# Altium project LimeSDR-X3_1v2.PrjPcb (part 14 of 16)

## Sheet 29_Clocks2.SchDoc: Clocks 2
size A3; Organization: Lime Microsystems; Address1: Surrey Tech Centre; Address2: Guildford GU2 7YG; Address3: Surrey; Address4: United Kingdom; Revision: v1.1; SheetNumber: 29; SheetTotal: 31
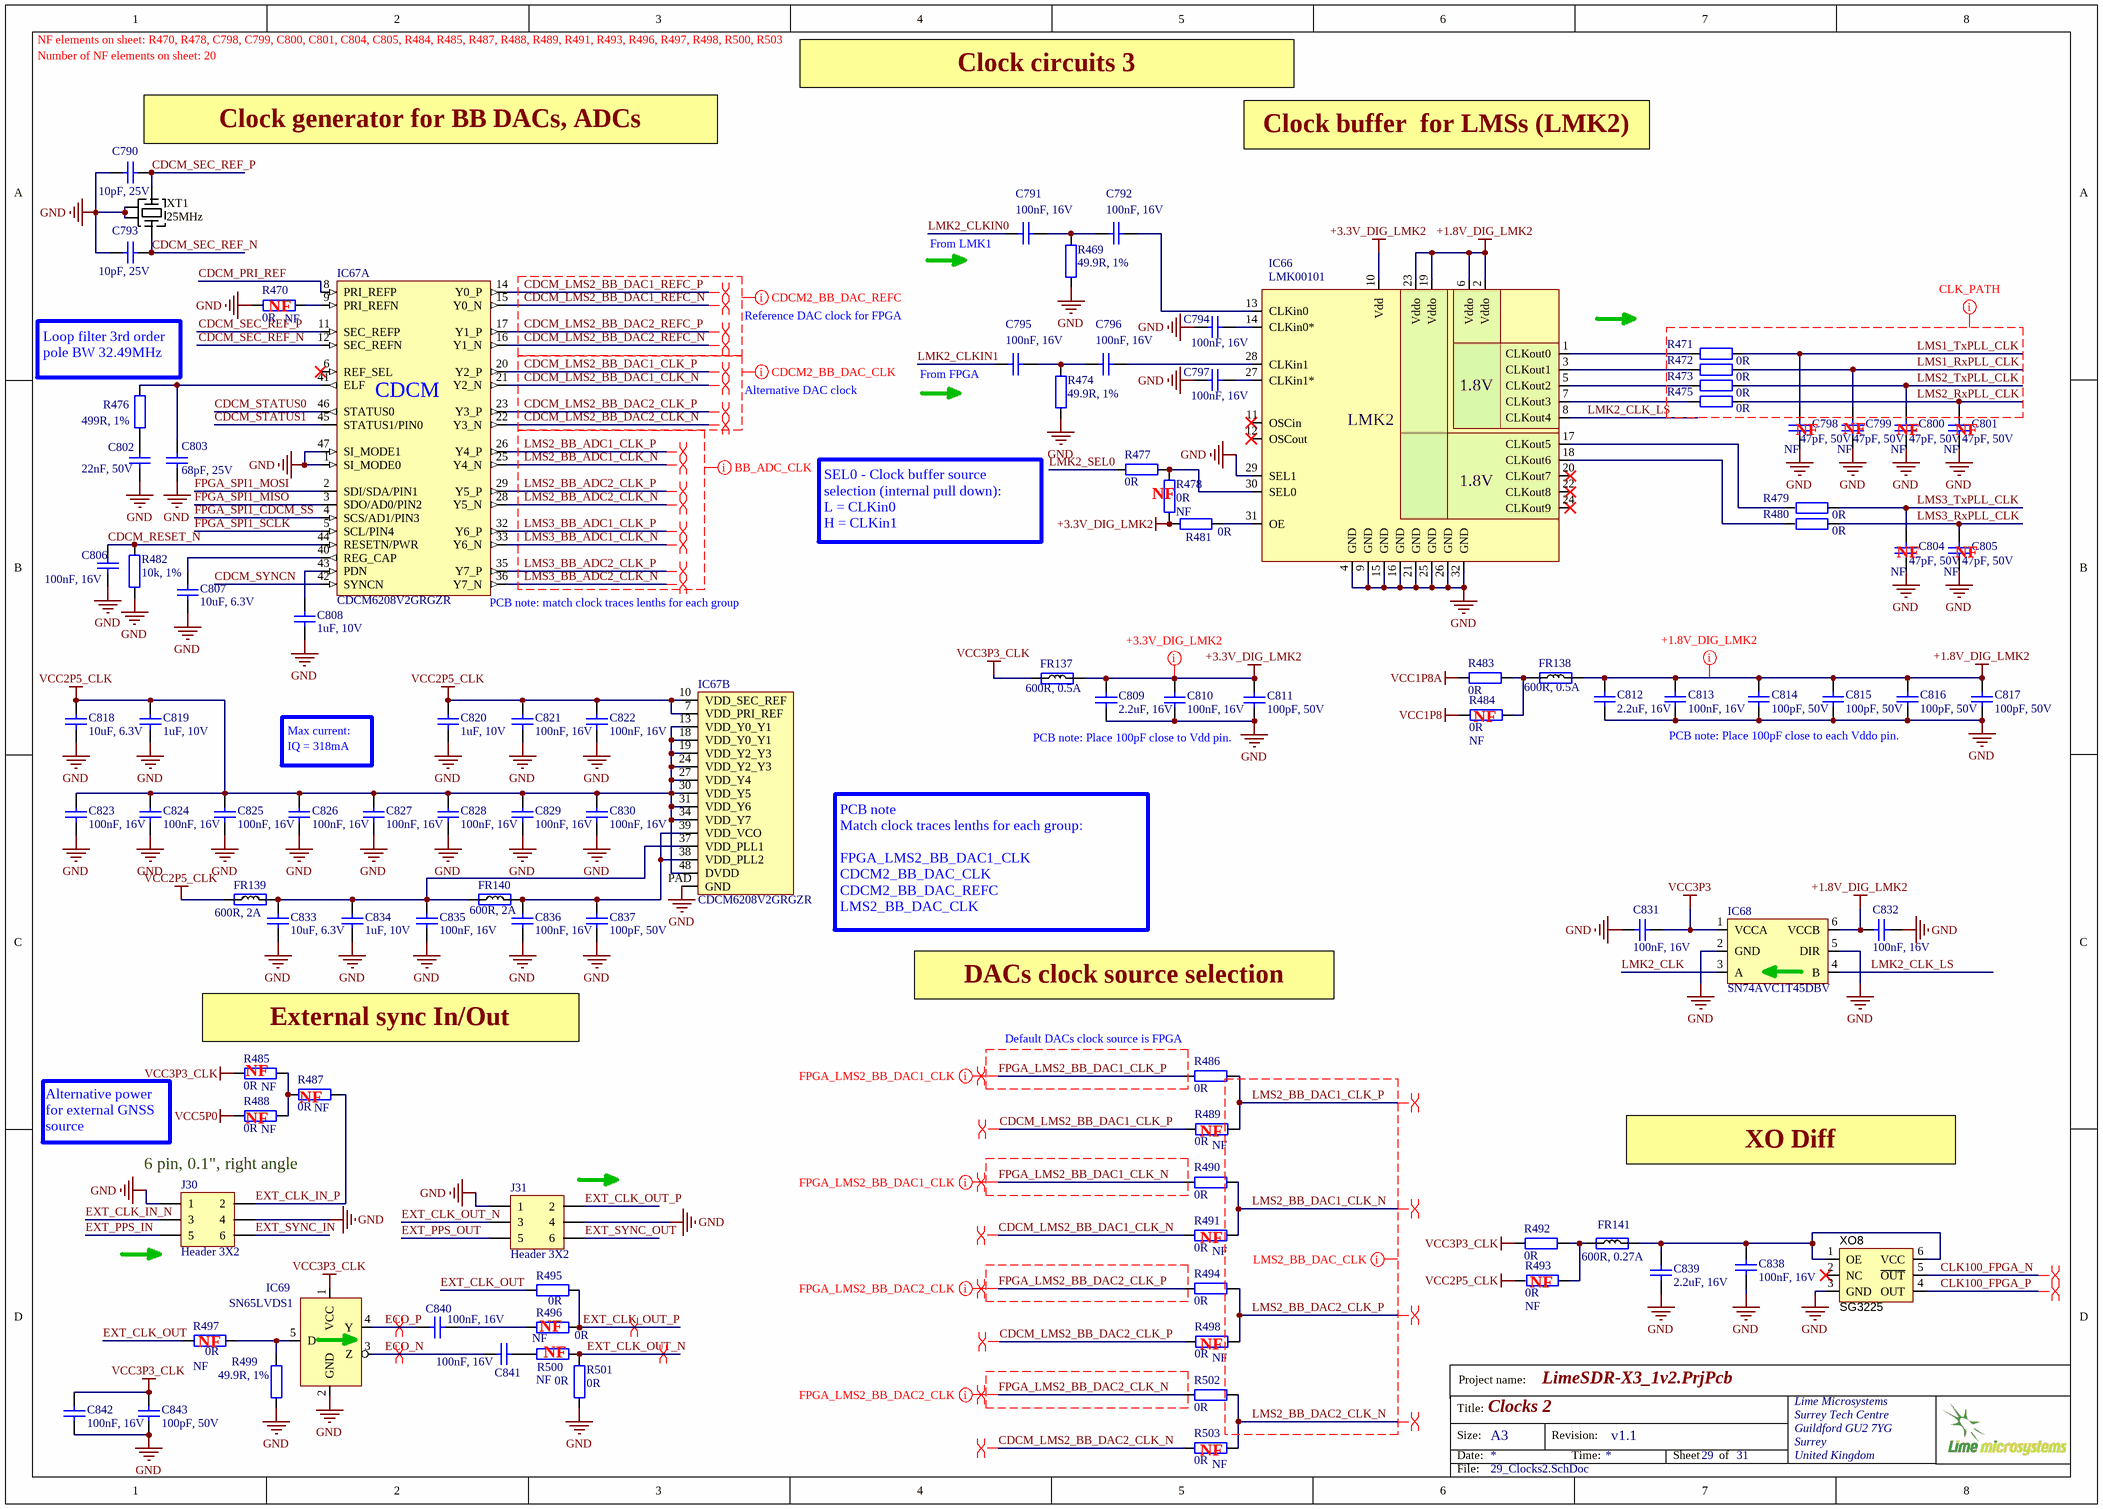
[diagram p17: 29_Clocks2.SchDoc]

### Parts
C790  10pF, 25V  [CAP0402]
C791  100nF, 16V  [CAP0402]
C792  100nF, 16V  [CAP0402]
C793  10pF, 25V  [CAP0402]
C794  100nF, 16V  [CAP0402]
C795  100nF, 16V  [CAP0402]
C796  100nF, 16V  [CAP0402]
C797  100nF, 16V  [CAP0402]
C798  47pF, 50V  Assembly Info: NF  [CAP0402]
C799  47pF, 50V  Assembly Info: NF  [CAP0402]
C800  47pF, 50V  Assembly Info: NF  [CAP0402]
C801  47pF, 50V  Assembly Info: NF  [CAP0402]
C802  22nF, 50V  [CAP0402]
C803  68pF, 25V  [CAP0402]
C804  47pF, 50V  Assembly Info: NF  [CAP0402]
C805  47pF, 50V  Assembly Info: NF  [CAP0402]
C806  100nF, 16V  [CAP0402]
C807  10uF, 6.3V  [CAP0603]
C808  1uF, 10V  [CAP0402]
C809  2.2uF, 16V  [CAP0402]
C810  100nF, 16V  [CAP0402]
C811  100pF, 50V  [CAP0402]
C812  2.2uF, 16V  [CAP0402]
C813  100nF, 16V  [CAP0402]
C814  100pF, 50V  [CAP0402]
C815  100pF, 50V  [CAP0402]
C816  100pF, 50V  [CAP0402]
C817  100pF, 50V  [CAP0402]
C818  10uF, 6.3V  [CAP0603]
C819  1uF, 10V  [CAP0402]
C820  1uF, 10V  [CAP0402]
C821  100nF, 16V  [CAP0402]
C822  100nF, 16V  [CAP0402]
C823  100nF, 16V  [CAP0402]
C824  100nF, 16V  [CAP0402]
C825  100nF, 16V  [CAP0402]
C826  100nF, 16V  [CAP0402]
C827  100nF, 16V  [CAP0402]
C828  100nF, 16V  [CAP0402]
C829  100nF, 16V  [CAP0402]
C830  100nF, 16V  [CAP0402]
C831  100nF, 16V  [CAP0402]
C832  100nF, 16V  [CAP0402]
C833  10uF, 6.3V  [CAP0603]
C834  1uF, 10V  [CAP0402]
C835  100nF, 16V  [CAP0402]
C836  100nF, 16V  [CAP0402]
C837  100pF, 50V  [CAP0402]
C838  100nF, 16V  [CAP0402]
C839  2.2uF, 16V  [CAP0402]
C840  100nF, 16V  [CAP0402]
C841  100nF, 16V  [CAP0402]
C842  100nF, 16V  [CAP0402]
C843  100pF, 50V  [CAP0402]
FR137  value 600R, 0.5A  [RES0402]  (hidden comment: Ferrite)
FR138  value 600R, 0.5A  [RES0402]  (hidden comment: Ferrite)
FR139  600R, 2A  [RES0805]
FR140  600R, 2A  [RES0805]
FR141  value 600R, 0.27A  [RES0201]  (hidden comment: Ferrite)
IC66  LMK00101  [LMK00101_WQFN32]
IC67  CDCM6208V2GRGZR  [CDCM6208V2G _VQFN48]  (parts A,B of 2)
IC68  SN74AVC1T45DBV  [SOT23-6]
IC69  SN65LVDS1  [SOT23-5]
J30  Header 3X2  [BHR-06-HUA_2x3_EDGE_HEADER]
J31  Header 3X2  [BHR-06-HUA_2x3_EDGE_HEADER]
R469  49.9R, 1%  [RES0402]
R470  0R  Assembly Info: NF  [RES0402]
R471  0R  [RES0402]
R472  0R  [RES0402]
R473  0R  [RES0402]
R474  49.9R, 1%  [RES0402]
R475  0R  [RES0402]
R476  499R, 1%  [RES0402]
R477  0R  [RES0402]
R478  0R  Assembly Info: NF  [RES0402]
R479  0R  [RES0402]
R480  0R  [RES0402]
R481  0R  [RES0402]
R482  10k, 1%  [RES0402]
R483  0R  [RES0402]
R484  0R  Assembly Info: NF  [RES0402]
R485  0R  Assembly Info: NF  [RES0402]
R486  0R  [RES0402]
R487  0R  Assembly Info: NF  [RES0402]
R488  0R  Assembly Info: NF  [RES0402]
R489  0R  Assembly Info: NF  [RES0402]
R490  0R  [RES0402]
R491  0R  Assembly Info: NF  [RES0402]
R492  0R  [RES0402]
R493  0R  Assembly Info: NF  [RES0402]
R494  0R  [RES0402]
R495  0R  [RES0402]
R496  0R  Assembly Info: NF  [RES0402]
R497  0R  Assembly Info: NF  [RES0402]
R498  0R  Assembly Info: NF  [RES0402]
R499  49.9R, 1%  [RES0402]
R500  0R  Assembly Info: NF  [RES0402]
R501  0R  [RES0402]
R502  0R  [RES0402]
R503  0R  Assembly Info: NF  [RES0402]
XO8  SG3225  [CRYSTAL_6-LCC]
XT1  25MHz  [CRYSTAL_4-LCC]

### Nets
+1.8V_DIG_LMK2: C812.2 C813.2 C814.2 C815.2 C816.2 C817.2 C832.1 FR138.2 IC66.2(Vddo) IC66.6(Vddo) IC66.19(Vddo) IC66.23(Vddo) IC68.6(VCCB)
+3.3V_DIG_LMK2: C809.2 C810.2 C811.2 FR137.2 IC66.10(Vdd) R478.2 R481.1
GND: C790.1 C793.1 C794.1 C797.1 C798.1 C799.1 C800.1 C801.1 C802.2 C803.2 C804.1 C805.1 C806.1 C807.2 C808.2 C809.1 C810.1 C811.1 C812.1 C813.1 C814.1 C815.1 C816.1 C817.1 C818.2 C819.2 C820.2 C821.1 C822.1 C823.1 C824.1 C825.1 C826.1 C827.1 C828.1 C829.1 C830.1 C831.1 C832.2 C833.2 C834.2 C835.1 C836.1 C837.1 C838.1 C839.1 C842.2 C843.1 IC66.4(GND) IC66.9(GND) IC66.15(GND) IC66.16(GND) IC66.21(GND) IC66.25(GND) IC66.26(GND) IC66.29(SEL1) IC66.32(GND) IC67.1(SI_MODE0) IC67.47(SI_MODE1) IC67.PAD(GND) IC68.2(GND) IC68.5(DIR) IC69.2(GND) J30.1 J30.4 J31.1 J31.4 R469.1 R470.2 R474.1 R482.2 R499.1 R501.1 XO8.3(GND) XT1.2(GND) XT1.4(GND)
VCC1P8: R484.2
VCC1P8A: R483.1
VCC2P5_CLK: C818.1 C819.1 C820.1 C821.2 C822.2 C823.2 C824.2 C825.2 C826.2 C827.2 C828.2 C829.2 C830.2 FR139.1 IC67.7(VDD_PRI_REF) IC67.10(VDD_SEC_REF) IC67.13(VDD_Y0_Y1) IC67.18(VDD_Y0_Y1) IC67.19(VDD_Y2_Y3) IC67.24(VDD_Y2_Y3) IC67.27(VDD_Y4) IC67.30(VDD_Y5) IC67.31(VDD_Y6) IC67.34(VDD_Y7) IC67.48(DVDD) R493.2
VCC3P3: C831.2 IC68.1(VCCA)
VCC3P3_CLK: C842.1 C843.2 FR137.1 IC69.1(VCC) R485.1 R492.1
VCC5P0: R488.1
CDCM_LMS2_BB_DAC1_CLK_N: IC67.21(Y2_N) R491.1
CDCM_LMS2_BB_DAC1_CLK_P: IC67.20(Y2_P) R489.1
CDCM_LMS2_BB_DAC1_REFC_N: IC67.15(Y0_N)
CDCM_LMS2_BB_DAC1_REFC_P: IC67.14(Y0_P)
CDCM_LMS2_BB_DAC2_CLK_N: IC67.22(Y3_N) R503.1
CDCM_LMS2_BB_DAC2_CLK_P: IC67.23(Y3_P) R498.1
CDCM_LMS2_BB_DAC2_REFC_N: IC67.16(Y1_N)
CDCM_LMS2_BB_DAC2_REFC_P: IC67.17(Y1_P)
CDCM_PRI_REF: IC67.8(PRI_REFP)
CDCM_RESET_N: C806.2 IC67.44(RESETN/PWR) R482.1
CDCM_SEC_REF_N: C793.2 IC67.12(SEC_REFN) XT1.3(X)
CDCM_SEC_REF_P: C790.2 IC67.11(SEC_REFP) XT1.1(X)
CDCM_STATUS0: IC67.46(STATUS0)
CDCM_STATUS1: IC67.45(STATUS1/PIN0)
CDCM_SYNCN: IC67.42(SYNCN)
CLK100_FPGA_N: XO8.5(~{OUT})
CLK100_FPGA_P: XO8.4(OUT)
ECO_N: C841.1 IC69.3(Z)
ECO_P: C840.1 IC69.4(Y)
EXT_CLK_IN_N: J30.3
EXT_CLK_IN_P: J30.2 R487.2
EXT_CLK_OUT: R495.2 R497.2
EXT_CLK_OUT_N: J31.3 R500.1 R501.2
EXT_CLK_OUT_P: J31.2 R495.1 R496.1
EXT_PPS_IN: J30.5
EXT_PPS_OUT: J31.5
EXT_SYNC_IN: J30.6
EXT_SYNC_OUT: J31.6
FPGA_LMS2_BB_DAC1_CLK_N: R490.1
FPGA_LMS2_BB_DAC1_CLK_P: R486.1
FPGA_LMS2_BB_DAC2_CLK_N: R502.1
FPGA_LMS2_BB_DAC2_CLK_P: R494.1
FPGA_SPI1_CDCM_SS: IC67.4(SCS/AD1/PIN3)
FPGA_SPI1_MISO: IC67.3(SDO/AD0/PIN2)
FPGA_SPI1_MOSI: IC67.2(SDI/SDA/PIN1)
FPGA_SPI1_SCLK: IC67.5(SCL/PIN4)
LMK2_CLK: IC68.3(A)
LMK2_CLK_LS: IC66.8(CLKout4) IC68.4(B)
LMK2_CLKIN0: C791.2
LMK2_CLKIN1: C795.2
LMK2_SEL0: R477.1
LMS1_RxPLL_CLK: C799.2 R472.1
LMS1_TxPLL_CLK: C798.2 R471.1
LMS2_BB_ADC1_CLK_N: IC67.25(Y4_N)
LMS2_BB_ADC1_CLK_P: IC67.26(Y4_P)
LMS2_BB_ADC2_CLK_N: IC67.28(Y5_N)
LMS2_BB_ADC2_CLK_P: IC67.29(Y5_P)
LMS2_BB_DAC1_CLK_N: R490.2 R491.2
LMS2_BB_DAC1_CLK_P: R486.2 R489.2
LMS2_BB_DAC2_CLK_N: R502.2 R503.2
LMS2_BB_DAC2_CLK_P: R494.2 R498.2
LMS2_RxPLL_CLK: C801.2 R475.1
LMS2_TxPLL_CLK: C800.2 R473.1
LMS3_BB_ADC1_CLK_N: IC67.33(Y6_N)
LMS3_BB_ADC1_CLK_P: IC67.32(Y6_P)
LMS3_BB_ADC2_CLK_N: IC67.36(Y7_N)
LMS3_BB_ADC2_CLK_P: IC67.35(Y7_P)
LMS3_RxPLL_CLK: C805.2 R480.1
LMS3_TxPLL_CLK: C804.2 R479.1
NetC791_1: C791.1 C792.2 R469.2
NetC792_1: C792.1 IC66.13(CLKin0)
NetC794_2: C794.2 IC66.14(CLKin0*)
NetC795_1: C795.1 C796.2 R474.2
NetC796_1: C796.1 IC66.28(CLKin1)
NetC797_2: C797.2 IC66.27(CLKin1*)
NetC802_1: C802.1 R476.2
NetC803_1: C803.1 IC67.41(ELF) R476.1
NetC807_1: C807.1 IC67.40(REG_CAP)
NetC808_1: C808.1 IC67.43(PDN)
NetC833_1: C833.1 C834.1 C835.2 FR139.2 FR140.1 IC67.37(VDD_PLL1)
NetC836_2: C836.2 C837.2 FR140.2 IC67.38(VDD_PLL2) IC67.39(VDD_VCO)
NetC838_2: C838.2 C839.2 FR141.2 XO8.1(OE) XO8.6(VCC)
NetC840_2: C840.2 R496.2
NetC841_2: C841.2 R500.2
NetFR138_1: FR138.1 R483.2 R484.1
NetFR141_1: FR141.1 R492.2 R493.1
NetIC66_1: IC66.1(CLKout0) R471.2
NetIC66_3: IC66.3(CLKout1) R472.2
NetIC66_5: IC66.5(CLKout2) R473.2
NetIC66_7: IC66.7(CLKout3) R475.2
NetIC66_17: IC66.17(CLKout5) R479.2
NetIC66_18: IC66.18(CLKout6) R480.2
NetIC66_30: IC66.30(SEL0) R477.2 R478.1
NetIC66_31: IC66.31(OE) R481.2
NetIC67_9: IC67.9(PRI_REFN) R470.1
NetIC69_5: IC69.5(D) R497.1 R499.2
NetR485_2: R485.2 R487.1 R488.2

Not connected (* = marked no-connect by the designer): IC66 11(OSCin)* 12(OSCout)* 20(CLKout7)* 22(CLKout8)* 24(CLKout9)*; IC67 6(REF_SEL)*; XO8 2(NC)*

### Layout directives
net class CLK_PATH: CDCM_LMS2_BB_DAC1_CLK_N, CDCM_LMS2_BB_DAC1_CLK_P, CDCM_LMS2_BB_DAC1_REFC_N, CDCM_LMS2_BB_DAC1_REFC_P, CDCM_LMS2_BB_DAC2_CLK_N, CDCM_LMS2_BB_DAC2_CLK_P, CDCM_LMS2_BB_DAC2_REFC_N, CDCM_LMS2_BB_DAC2_REFC_P, FPGA_LMS2_BB_DAC1_CLK_N, FPGA_LMS2_BB_DAC1_CLK_P, FPGA_LMS2_BB_DAC2_CLK_N, FPGA_LMS2_BB_DAC2_CLK_P, LMS1_RxPLL_CLK, LMS1_TxPLL_CLK, LMS2_BB_ADC1_CLK_N, LMS2_BB_ADC1_CLK_P, LMS2_BB_ADC2_CLK_N, LMS2_BB_ADC2_CLK_P, LMS2_BB_DAC1_CLK_N, LMS2_BB_DAC1_CLK_P, LMS2_BB_DAC2_CLK_N, LMS2_BB_DAC2_CLK_P, LMS2_RxPLL_CLK, LMS2_TxPLL_CLK, LMS3_BB_ADC1_CLK_N, LMS3_BB_ADC1_CLK_P, LMS3_BB_ADC2_CLK_N, LMS3_BB_ADC2_CLK_P
net class +1.8V_DIG_LMK: +1.8V_DIG_LMK2
net class +3.3V_DIG_LMK: +3.3V_DIG_LMK2
differential pair: CDCM_LMS2_BB_DAC1_CLK_N, CDCM_LMS2_BB_DAC1_CLK_P, CDCM_LMS2_BB_DAC1_REFC_N, CDCM_LMS2_BB_DAC1_REFC_P, CDCM_LMS2_BB_DAC2_CLK_N, CDCM_LMS2_BB_DAC2_CLK_P, CDCM_LMS2_BB_DAC2_REFC_N, CDCM_LMS2_BB_DAC2_REFC_P, CLK100_FPGA_N, CLK100_FPGA_P, ECO_N, ECO_P, EXT_CLK_OUT_N, EXT_CLK_OUT_P, FPGA_LMS2_BB_DAC1_CLK_N, FPGA_LMS2_BB_DAC1_CLK_P, FPGA_LMS2_BB_DAC2_CLK_N, FPGA_LMS2_BB_DAC2_CLK_P, LMS2_BB_ADC1_CLK_N, LMS2_BB_ADC1_CLK_P, LMS2_BB_ADC2_CLK_N, LMS2_BB_ADC2_CLK_P, LMS2_BB_DAC1_CLK_N, LMS2_BB_DAC1_CLK_P, LMS2_BB_DAC2_CLK_N, LMS2_BB_DAC2_CLK_P, LMS3_BB_ADC1_CLK_N, LMS3_BB_ADC1_CLK_P, LMS3_BB_ADC2_CLK_N, LMS3_BB_ADC2_CLK_P

### Notes on the sheet
- NF elements on sheet: R470, R478, C798, C799, C800, C801, C804, C805, R484, R485, R487, R488, R489, R491, R493, R496, R497, R498, R500, R503
- Number of NF elements on sheet: 20
- Clock circuits 3
- (near C790) Clock generator for BB DACs, ADCs
- Clock buffer  for LMSs (LMK2)
- (near C791) From LMK1
- (near R470) NF
- (near R476) Loop filter 3rd order pole BW 32.49MHz
- Reference DAC clock for FPGA
- (near C795) From FPGA
- (near IC67) CDCM
- Alternative DAC clock
- (near IC66) LMK2
- (near IC66) 1.8V
- (near C798) NF
- (near C799) NF
- (near C800) NF
- (near C801) NF
- (near R478) NF
- SEL0 - Clock buffer source selection (internal pull down):
  L = CLKin0
  H = CLKin1
- (near C804) NF
- (near C805) NF
- (near IC67) PCB note: match clock traces lenths for each group
- (near R484) NF
- IQ = 318mA
- Max current:
- PCB note: Place 100pF close to Vdd pin.
- PCB note: Place 100pF close to each Vddo pin.
- PCB note
  Match clock traces lenths for each group:
  FPGA_LMS2_BB_DAC1_CLK
  CDCM2_BB_DAC_CLK
  CDCM2_BB_DAC_REFC
  LMS2_BB_DAC_CLK
- (near R485) External sync In/Out
- DACs clock source selection
- (near R486) Default DACs clock source is FPGA
- (near R488) NF
- (near R485) NF
- (near R487) NF
- Alternative power for external GNSS source
- 6 pin, 0.1", right angle
- (near R489) NF
- XO Diff
- (near R491) NF
- (near R493) NF
- (near R497) NF
- (near R496) NF
- NF
- (near R498) NF
- (near R503) NF
- Project name:
- Title:
- Size:
- Date:
- A3
- Revision:
- Time:
- Sheet
- of
- File:

### Library data of the parts
C790 C793 = Cap_0402: Manufacturer: AVX; Part Description: 10pF ±5% 25V C0G, NP0 Ceramic Capacitor -55°C ~ 125°C Surface Mount, MLCC 0402 (1005 Metric) 0.039" L x 0.020" W (1.00mm x 0.50mm); Manufacturer Part Number 1: 04023A100JAT2A; Capacitance: 10; Ceramic Capacitor Case: 0402 [1005 Metric]; Capacitance Tolerance: ± 5%; Capacitor Case Style: 0402 [1005 Metric]<!--FANDB--><div class="features-and-benefits-container"></div>; Dielectric Characteristic: C0G / NP0; SVHC: No SVHC (16-Jun-2014); Voltage Rating: 25; Supplier 1: Farnell; Supplier Part Number 1: 2332478RL; value: 10pF, 25V; Capacitance Tolerance ±: ± 5%; MSL: MSL 1 - Unlimited; Operating Temperature Max: 125; Operating Temperature Min: -55; Packaging: Cut Tape; Product Range: -; RoHS: YES
C791 C792 C794-C797 C810 C813 = Cap_0402: as C737-C739 on sheet 28_Clocks1; Value: 100nF, 16V; Supplier 1: Mouser; Supplier Part Number 1: 81-GRM155R71C104KA88; Case Code - in: 0402; RoHS: RoHS Compliant; Operating Temperature Range: - 55 C to + 125 C; Series: GRM; Termination Style: SMD/SMT; Package / Case: 0402 (1005 metric); Voltage Rating DC: 16 V; Maximum Operating Temperature: + 125 C; Case Code - mm: 1005; Minimum Operating Temperature: - 55 C; Product Category: Low & Medium Capacitance SMD Ceramic Chip Capacitors; Packaging: Reel; Product: General Type MLCCs; Category: Multilayer Ceramic Capacitors MLCC - SMD/SMT; Brand: Murata Electronics; Case Width: 0.5 mm; RoHS - Mouser: Y; Standard Pack Qty: 10000; Minimum Order Quantity: 1; Reeling: True; Manufacturer Part Number 1: GRM155R71C104KA88D
C798-C801 C804 C805 = Cap_0402: Manufacturer Part Number 1: C1005C0G1H470F050BA; Manufacturer: TDK Corporation; Part Description: 47pF ±1% 50V Ceramic Capacitor C0G, NP0 0402 (1005 Metric); Temperature Coefficient: C0G, NP0; Tolerance: ±1%; Value: 47pF, 50V; Supplier 1: Digi-Key; Supplier Part Number 1: 445-5361-1-ND; Package / Case: 0402 (1005 Metric); Voltage - Rated: 50V; Lead Spacing: -; Ratings: -; Mounting Type: Surface Mount, MLCC; Operating Temperature: -55°C ~ 125°C; Thickness (Max): 0.022" (0.55mm); Capacitance: 47pF; Packaging: Cut Tape (CT); Features: -; Applications: General Purpose; Lead Style: -; Size / Dimension: 0.039" L x 0.020" W (1.00mm x 0.50mm); Height - Seated (Max): -; RoHS: RoHS Compliant; Category: Capacitors
C802 = Cap_0402: Manufacturer: Kemet; Manufacturer Part Number 1: C0402C223K5RACTU; Part Description: 0.022µF ±10% 50V Ceramic Capacitor X7R 0402 (1005 Metric); Temperature Coefficient: X7R; Tolerance: ±10%; Capacitance: 0.022µF; Value: 22nF, 50V; Supplier 1: Digi-Key; Supplier Part Number 1: 399-7780-1-ND; Ratings: -; Packaging: Cut Tape (CT); Category: Capacitors; Size / Dimension: 0.039" L x 0.020" W (1.00mm x 0.50mm); RoHS: RoHS Compliant; Operating Temperature: -55°C ~ 125°C; Mounting Type: Surface Mount, MLCC; Applications: General Purpose; Voltage - Rated: 50V; Thickness (Max): 0.022" (0.55mm); Features: -; Height - Seated (Max): -; Lead Style: -; Package / Case: 0402 (1005 Metric); Lead Spacing: -
C803 = Cap_0402: Manufacturer Part Number 1: CBR04C680F3GAC; Manufacturer: Kemet; Part Description: 68pF ±1% 25V Ceramic Capacitor C0G, NP0 0402 (1005 Metric); Temperature Coefficient: C0G, NP0; Tolerance: ±1%; Value: 68pF, 25V; Supplier 1: Digi-Key; Supplier Part Number 1: 399-11255-1-ND; Applications: RF, Microwave, High Frequency; Voltage - Rated: 25V; Capacitance: 68pF; Mounting Type: Surface Mount, MLCC; Package / Case: 0402 (1005 Metric); Features: High Q, Low Loss; Lead Spacing: -; Size / Dimension: 0.039" L x 0.020" W (1.00mm x 0.50mm); Operating Temperature: -55°C ~ 125°C; Packaging: Cut Tape (CT); Thickness (Max): 0.022" (0.55mm); Category: Capacitors; Lead Style: -; Ratings: -; Height - Seated (Max): -; RoHS: RoHS Compliant
C806 C821-C830 C835 C836 = Cap_0402: as C744 on sheet 28_Clocks1; Value: 100nF, 16V; Supplier 1: Mouser; Supplier Part Number 1: 81-GRM155R71C104KA88; Case Code - in: 0402; RoHS: RoHS Compliant; Operating Temperature Range: - 55 C to + 125 C; Series: GRM; Termination Style: SMD/SMT; Package / Case: 0402 (1005 metric); Voltage Rating DC: 16 V; Maximum Operating Temperature: + 125 C; Case Code - mm: 1005; Minimum Operating Temperature: - 55 C; Product Category: Low & Medium Capacitance SMD Ceramic Chip Capacitors; Packaging: Reel; Product: General Type MLCCs; Category: Multilayer Ceramic Capacitors MLCC - SMD/SMT; Brand: Murata Electronics; Case Width: 0.5 mm; RoHS - Mouser: Y; Standard Pack Qty: 10000; Minimum Order Quantity: 1; Reeling: True
C807 C818 C833 = Cap_0603: as C761 on sheet 28_Clocks1; Supplier 1: Digi-Key; Supplier Part Number 1: 311-1448-2-ND; Package / Case: 0603 (1608 Metric); Category: Capacitors; Voltage - Rated: 6.3V; Value: 10uF, 6.3V
C808 C819 C820 C834 = Cap_0402: as C771 on sheet 28_Clocks1; Value: 1uF, 10V; Supplier 1: Digi-Key; Supplier Part Number 1: 445-9066-1-ND; MSL: -; RoHS: YES
C809 C812 C839 = Cap_0402: as C749 on sheet 28_Clocks1; Value: 2.2uF, 16V; Supplier 1: Digi-Key; Supplier Part Number 1: 445-9085-6-ND; Category: Capacitors; Voltage - Rated: 16V; Thickness (Max): 0.022" (0.55mm); Applications: General Purpose; Package / Case: 0402 (1005 Metric); Size / Dimension: 0.039" L x 0.020" W (1.00mm x 0.50mm); Features: -; Temperature Coefficient: X5R; Mounting Type: Surface Mount, MLCC; Ratings: -; Lead Style: -; Operating Temperature: -55°C ~ 85°C; Lead Spacing: -; RoHS: RoHS Compliant; Height - Seated (Max): -; Packaging: Tape & Reel (TR); Operating Temperature Range: -55°C to +85
C811 C814-C817 C837 C843 = Cap_0402: as C751-C753 on sheet 28_Clocks1; Value: 100pF, 50V; Supplier 1: Digi-Key; Supplier Part Number 1: 311-1024-1-ND; RoHS: RoHS Compliant; Category: Capacitors; Applications: General Purpose; Mounting Type: Surface Mount, MLCC; Capacitance: 100pF; Ratings: -; Packaging: Cut Tape (CT); Voltage - Rated: 50V; Size / Dimension: 0.039" L x 0.020" W (1.00mm x 0.50mm); Height - Seated (Max): -; Package / Case: 0402 (1005 Metric); Operating Temperature: -55°C ~ 125°C; Features: -; Lead Spacing: -; Lead Style: -; Thickness (Max): 0.022" (0.55mm)
C831 C832 = Cap_0603: Part Description: 0.10µF ±10% 16V X7R Ceramic Capacitor -55°C ~ 125°C Surface Mount, MLCC 0402 (1005 Metric) 0.039" L x 0.020" W (1.00mm x 0.50mm); Manufacturer Part Number 1: GRM155R71C104KA88D; Brand: Murata Electronics; Tolerance: 10 %; Type: General Purpose MLCC; Capacitance: 0.1 uF; Temperature Coefficient / Code: +/- 15 %; Case Height: 0.5 mm; Case Length: 1 mm; Dielectric: X7R; Supplier 1: Mouser; Supplier Part Number 1: 81-GRM155R71C104KA88; Case Code - in: 0402; Manufacturer: Murata Electronics; Category: Multilayer Ceramic Capacitors MLCC - SMD/SMT; Voltage Rating DC: 16 V; Value: 100nF, 16V; Case Code - mm: 1005; Case Width: 0.5 mm; Maximum Operating Temperature: + 125 C; Minimum Operating Temperature: - 55 C; Minimum Order Quantity: 1; Operating Temperature Range: - 55 C to + 125 C; Package / Case: 0402 (1005 metric); Packaging: Reel; Product: General Type MLCCs; Product Category: Low & Medium Capacitance SMD Ceramic Chip Capacitors; Reeling: True; RoHS - Mouser: Y; RoHS: RoHS Compliant; Series: GRM; Standard Pack Qty: 10000; Termination Style: SMD/SMT
C838 C840-C842 = Cap_0603: as C785 on sheet 28_Clocks1; Supplier 1: Mouser; Supplier Part Number 1: 81-GRM155R71C104KA88; Case Code - in: 0402; Manufacturer: Murata Electronics; Category: Multilayer Ceramic Capacitors MLCC - SMD/SMT; Voltage Rating DC: 16 V; Value: 100nF, 16V; Case Code - mm: 1005; Case Width: 0.5 mm; Maximum Operating Temperature: + 125 C; Minimum Operating Temperature: - 55 C; Minimum Order Quantity: 1; Operating Temperature Range: - 55 C to + 125 C; Package / Case: 0402 (1005 metric); Packaging: Reel; Product: General Type MLCCs; Product Category: Low & Medium Capacitance SMD Ceramic Chip Capacitors; Reeling: True; RoHS - Mouser: Y; RoHS: RoHS Compliant; Series: GRM; Standard Pack Qty: 10000; Termination Style: SMD/SMT
  C840-C842: Manufacturer Part Number: GRM155R71C104KA88D
FR137 FR138 = Ferrite: as FR133-FR135 on sheet 28_Clocks1; Supplier 1: Digi-Key; Supplier Part Number 1: 490-5441-1-ND; Stock 1: 416370; Pricing 1: 1=0.1, 10=0.06, 25=0.0552, 50=0.0496, 100=0.0363, 250=0.0264, 500=0.0242, 1000=0.0209, 5000=0.0165 (USD); Case/Package: 0402; Number of Pins: 2; Case Code (Metric): 1005; Case Code (Imperial): 0402; Core Material: Ferrite; Material: Steel,Ferrite; Min Operating Temperature: -55°C; Max Operating Temperature: 125°C; Package Quantity: 1; Packaging: Tape and Reel; Series: BLM15AX_SN; Max Current Rating: 500mA; Termination: SMD/SMT; Max DC Current: 500mA; Number of Circuits: 1; DC Resistance-Max: 340mR; Length: 1mm; Width: 0.5mm; Height: 0.5mm; Depth: 0.5mm; REACH SVHC: No SVHC; Lead Free: Lead Free; RoHS Compliant: Yes; ComponentLink1URL: https://www.murata.com/en-us/products/productdata/8796740059166/ENFA0018.pdf?src-supplier=Digi-Key; ComponentLink1Description: https://www.murata.com/en-us/products/productdata/8796740059166/ENFA0018.pdf?src-supplier=Digi-Key; ComponentLink2URL: http://search.murata.co.jp/Ceramy/image/img/PDF/ENG/L0110S0100BLM15AX_SN.pdf?src-supplier=Future+Electronics; ComponentLink2Description: http://search.murata.co.jp/Ceramy/image/img/PDF/ENG/L0110S0100BLM15AX_SN.pdf?src-supplier=Future+Electronics; ComponentLink3URL: http://www.produktinfo.conrad.com/datenblaetter/1100000-1199999/001171675-da-01-en-CHIP_DROSSEL0402_600R_420MA_1_0X0_5MM.pdf?src-supplier=Conrad; ComponentLink3Description: http://www.produktinfo.conrad.com/datenblaetter/1100000-1199999/001171675-da-01-en-CHIP_DROSSEL0402_600R_420MA_1_0X0_5MM.pdf?src-supplier=Conrad; ComponentLink4URL: http://www.produktinfo.conrad.com/datenblaetter/1100000-1199999/001172169-da-01-en-DROSSEL_0402_600R_1_0X0_5MM_10000ST.pdf?src-supplier=Conrad; ComponentLink4Description: http://www.produktinfo.conrad.com/datenblaetter/1100000-1199999/001172169-da-01-en-DROSSEL_0402_600R_1_0X0_5MM_10000ST.pdf?src-supplier=Conrad
FR139 FR140 = Ferrite: Manufacturer Part Number 1: MPZ2012S601AT000; Manufacturer: TDK Corporation; Part Description: FERRITE BEAD 600 OHM 0805 1LN; Filter Type: Differential Mode - Single; Impedance @ Frequency: 600 Ohm @ 100MHz; DC Resistance (DCR): 100 mOhm Max; Supplier 1: Digi-Key; Supplier Part Number 1: 445-2206-2-ND; Mounting Type: Surface Mount; RoHS: RoHS Compliant; Height (Max): 0.041" (1.05mm); Packaging: Tape & Reel (TR); Category: Filters; Current Rating: 2A; Package / Case: 0805 (2012 Metric); Size / Dimension: 0.079" L x 0.049" W (2.00mm x 1.25mm); Value: 600R, 2A
FR141 = Ferrite: as FR136 on sheet 28_Clocks1; Supplier 1: Digi-Key; Supplier Part Number 1: 587-3277-1-ND; Size / Dimension: 0.024" L x 0.012" W (0.60mm x 0.30mm); Package / Case: 0201 (0603 Metric); Height (Max): 0.013" (0.33mm); Mounting Type: Surface Mount; Packaging: Cut Tape (CT); RoHS: RoHS Compliant; Category: Filters
IC66 = LMK00101: as IC62 on sheet 28_Clocks1; Supplier 1: Digi-Key; Mounting Type: Surface Mount; Package / Case: 32-WFQFN Exposed Pad; RoHS: RoHS Compliant; Operating Temperature: -40°C ~ 85°C; Type: Fanout Buffer (Distribution), Multiplexer, Translator; Category: Integrated Circuits (ICs); Packaging: Cut Tape (CT); Supplier Device Package: 32-WQFN (5x5); Supplier Part Number 1: 296-39036-1-ND
IC67 = CDCM6208V2GRGZR: Manufacturer: Texas Instruments; Part Description: IC CLK GEN 2:8 LOW JITTER 48VQFN; Number of Circuits: 1; Max Frequency: 800MHz; Input: Crystal; Number of Outputs: 8; Supplier 1: Digi-Key; Manufacturer Part Number 1: CDCM6208V2GRGZR; Stock 1: 1501; Pricing 1: 1 = 11,22000, 10 = 10,13400, 100 = 8,38960, 500 = 7,30558, 1000 = 6,36293 (USD); RoHS: Yes; Mount: Surface Mount; Case/Package: VQFN; Min Operating Temperature: -40°C; Max Operating Temperature: 85°C; Packaging: Tape and Reel; Lead Free: Lead Free; ComponentLink1URL: http://www.ti.com/lit/ds/symlink/cdcm6208v2g.pdf?src-supplier=Digi-Key; ComponentLink1Description: http://www.ti.com/lit/ds/symlink/cdcm6208v2g.pdf?src-supplier=Digi-Key; ComponentLink2URL: http://www.ti.com/lit/gpn/cdcm6208v2g?src-supplier=Mouser; ComponentLink2Description: http://www.ti.com/lit/gpn/cdcm6208v2g?src-supplier=Mouser; Supplier Part Number 1: 296-51011-1-ND
IC68 = SN74AVC1T45DBV: Manufacturer: Texas Instruments; Part Description: Voltage Level Translator Bidirectional 1 Circuit 1 Channel 500Mbps SOT-23-6; Manufacturer Part Number 1: SN74AVC1T45DBVR; Data Rate: 500Mbps; Voltage - Supply: 1.2 V ~ 3.6 V; Supplier 1: Digi-Key; Category: Integrated Circuits (ICs); Package / Case: SOT-23-6; Supplier Part Number 1: 296-19094-1-ND
IC69 = SN65LVDS1: Manufacturer: TEXAS INSTRUMENTS; Manufacturer Part Number 1: SN65LVDS1DBVR; Part Description: DIFFERENTIAL LINE DRIVER/RECEIVER SIGNAL SOT23-5; Supply Voltage Min: 2.4; Supply Voltage Max: 3.6; No. of Pins: 5; Driver Case Style: SOT-23; Supplier 1: Newark; Supplier Part Number 1: 76C0715
J30 J31 = Header 3X2: Header, 2-Pin, Dual row; Manufacturer: Adam Equipment; Manufacturer Part Number 1: BHR-06-HUA; Part Description: Connector Header Through Hole, Right Angle 6 position 0.100" (2.54mm); Supplier 1: Digi-Key; Supplier Part Number 1: 2057-BHR-06-HUA-ND; Stock 1: 1572; Pricing 1: 1=0.3, 10=0.283, 100=0.198, 500=0.16968, 1000=0.1414, 5000=0.1212, 10000=0.11312 (USD)
R469 R474 R499 = Res_0402: as R418 on sheet 28_Clocks1; Number of Terminations: 2; Size / Dimension: 0.039" L x 0.020" W (1.00mm x 0.50mm); Supplier Device Package: 0402 (1005 Metric); RoHS: RoHS Compliant; Supplier Part Number 1: 1276-3469-6-ND; Features: -; Packaging: Digi-Reel®; Tolerance: ±1%; Height: 0.016" (0.40mm); Category: Resistors; Composition: Thick Film; Package / Case: 0402 (1005 Metric); Supplier 1: Digi-Key; Operating Temperature: -55°C ~ 155°C; Value: 49.9R, 1%
R470-R473 R475 R477-R481 R483-R498 R500-R503 = Res_0402: as R419-R421 on sheet 28_Clocks1; Value: 0R; Supplier 1: Digi-Key; Supplier Part Number 1: 311-0.0JRTR-ND; Category: Resistors; Temperature Coefficient: -; Features: Moisture Resistant; Supplier Device Package: 0402; Height: 0.016" (0.40mm); Package / Case: 0402 (1005 Metric); Operating Temperature: -55°C ~ 155°C; Size / Dimension: 0.039" L x 0.020" W (1.00mm x 0.50mm); Composition: Thick Film; Packaging: Tape & Reel (TR); Number of Terminations: 2; RoHS: RoHS Compliant
R476 = Res_0402: Manufacturer: Vishay; Manufacturer Part Number 1: CRCW0402499RFKEDC; Part Description: 499 Ohms ±1% 0.063W, 1/16W Chip Resistor 0402 (1005 Metric)  Thick Film; Power Rating: 62.5mW; Temperature Coefficient: 100ppm/°C; Value: 499R, 1%; ComponentLink1URL: http://www.yageo.com/documents/recent/PYu-RC_Group_51_RoHS_L_9.pdf?src-supplier=Digi-Key; ComponentLink1Description: http://www.yageo.com/documents/recent/PYu-RC_Group_51_RoHS_L_9.pdf?src-supplier=Digi-Key; ComponentLink2URL: http://www.yageo.com/documents/recent/PYu-RC_Group_51_RoHS_L_10.pdf?src-supplier=Digi-Key; ComponentLink2Description: http://www.yageo.com/documents/recent/PYu-RC_Group_51_RoHS_L_10.pdf?src-supplier=Digi-Key; ComponentLink3URL: http://www.mouser.com/ds/2/447/PYu-RC0402_51_RoHS_L_6_r-8721.pdf?src-supplier=Mouser; ComponentLink3Description: http://www.mouser.com/ds/2/447/PYu-RC0402_51_RoHS_L_6_r-8721.pdf?src-supplier=Mouser; ComponentLink4URL: http://www.farnell.com/datasheets/1018594.pdf?src-supplier=Element14; ComponentLink4Description: http://www.farnell.com/datasheets/1018594.pdf?src-supplier=Element14; Supplier 1: Digi-Key; Supplier Part Number 1: 541-4007-1-ND; Stock 1: 49540; Pricing 1: 1=0.1, 10=0.032, 100=0.013, 1000=0.00583, 2500=0.00506, 5000=0.00418 (USD); Mount: Surface Mount; Case/Package: SMD/SMT; Contact Plating: Tin; Min Operating Temperature: -55°C; Max Operating Temperature: 155°C; Resistance: 499R; Tolerance: 1%; Composition: Thick Film; Termination: Wraparound; Length: 1mm; Lead Free: Lead Free
R482 = Res_0402: as R443 on sheet 28_Clocks1; Value: 10k, 1%; Supplier 1: Digi-Key; Supplier Part Number 1: 311-10.0KLRTR-ND; Resistance (Ohms): 10k; Packaging: Tape & Reel (TR); RoHS: RoHS Compliant; Package / Case: 0402 (1005 Metric); Tolerance: ±1%; Operating Temperature: -55°C ~ 155°C; Size / Dimension: 0.039" L x 0.020" W (1.00mm x 0.50mm); Number of Terminations: 2; Category: Resistors; Height: 0.016" (0.40mm); Supplier Device Package: 0402; Features: Moisture Resistant; Composition: Thick Film
XO8 = CRYSTAL_SG3225: Oscillator Crystal; Manufacturer: Epson; Manufacturer Part Number 1: SG3225VAN100.000000M-KEGA3; Part Description: 100MHz XO (Standard) LVDS Oscillator 2.5V ~ 3.3V Enable/Disable 6-SMD, No Lead; Frequency: 100MHz; Max Supply Current: 30mA; Frequency Stability: 30ppm; Supplier 1: Digi-Key; Supplier Part Number 1: SER4356CT-ND; Stock 1: 1219; Pricing 1: 1=2.29, 10=2.241, 50=2.134, 100=1.8673 (USD); Mount: Surface Mount; Case/Package: SMD/SMT; Min Operating Temperature: -40°C; Max Operating Temperature: 85°C; Packaging: Tape and Reel; Length: 0.126inch; Height: 0.047inch; Width: 0.098inch
XT1 = CRYSTAL_19M2: Oscillator Crystal 25 MHz; Manufacturer Part Number 1: ABM8-25.000MHZ-B2-T; Manufacturer: ABRACON; Part Description: 25MHz ±20ppm Crystal 18pF 50 Ohm -20°C ~ 70°C Surface Mount 4-SMD, No Lead (DFN, LCC); Supplier 1: Newark; Supplier Part Number 1: 13J1767